# Altium schematic sheet ETH_PHY.SchDoc: =SheetTitle_Top
size 420 x 297 mm; Author: G.Kasprowicz; CompanyName: WUT ISE; DrawnBy: G.Kasprowicz; Organization: WUT ISE; Address1: PW ISE; Address2: Nowowiejska 15/19 00-665 Warsaw; Address3: gkasprow@gmail.com; ModifiedBy: -; CheckedDate: -; Title2: ETH PHY; DivGrp: WUT ISE; Designer: G.Kasprowicz; ModifiedDate: -; ProjectName: Sensor Box
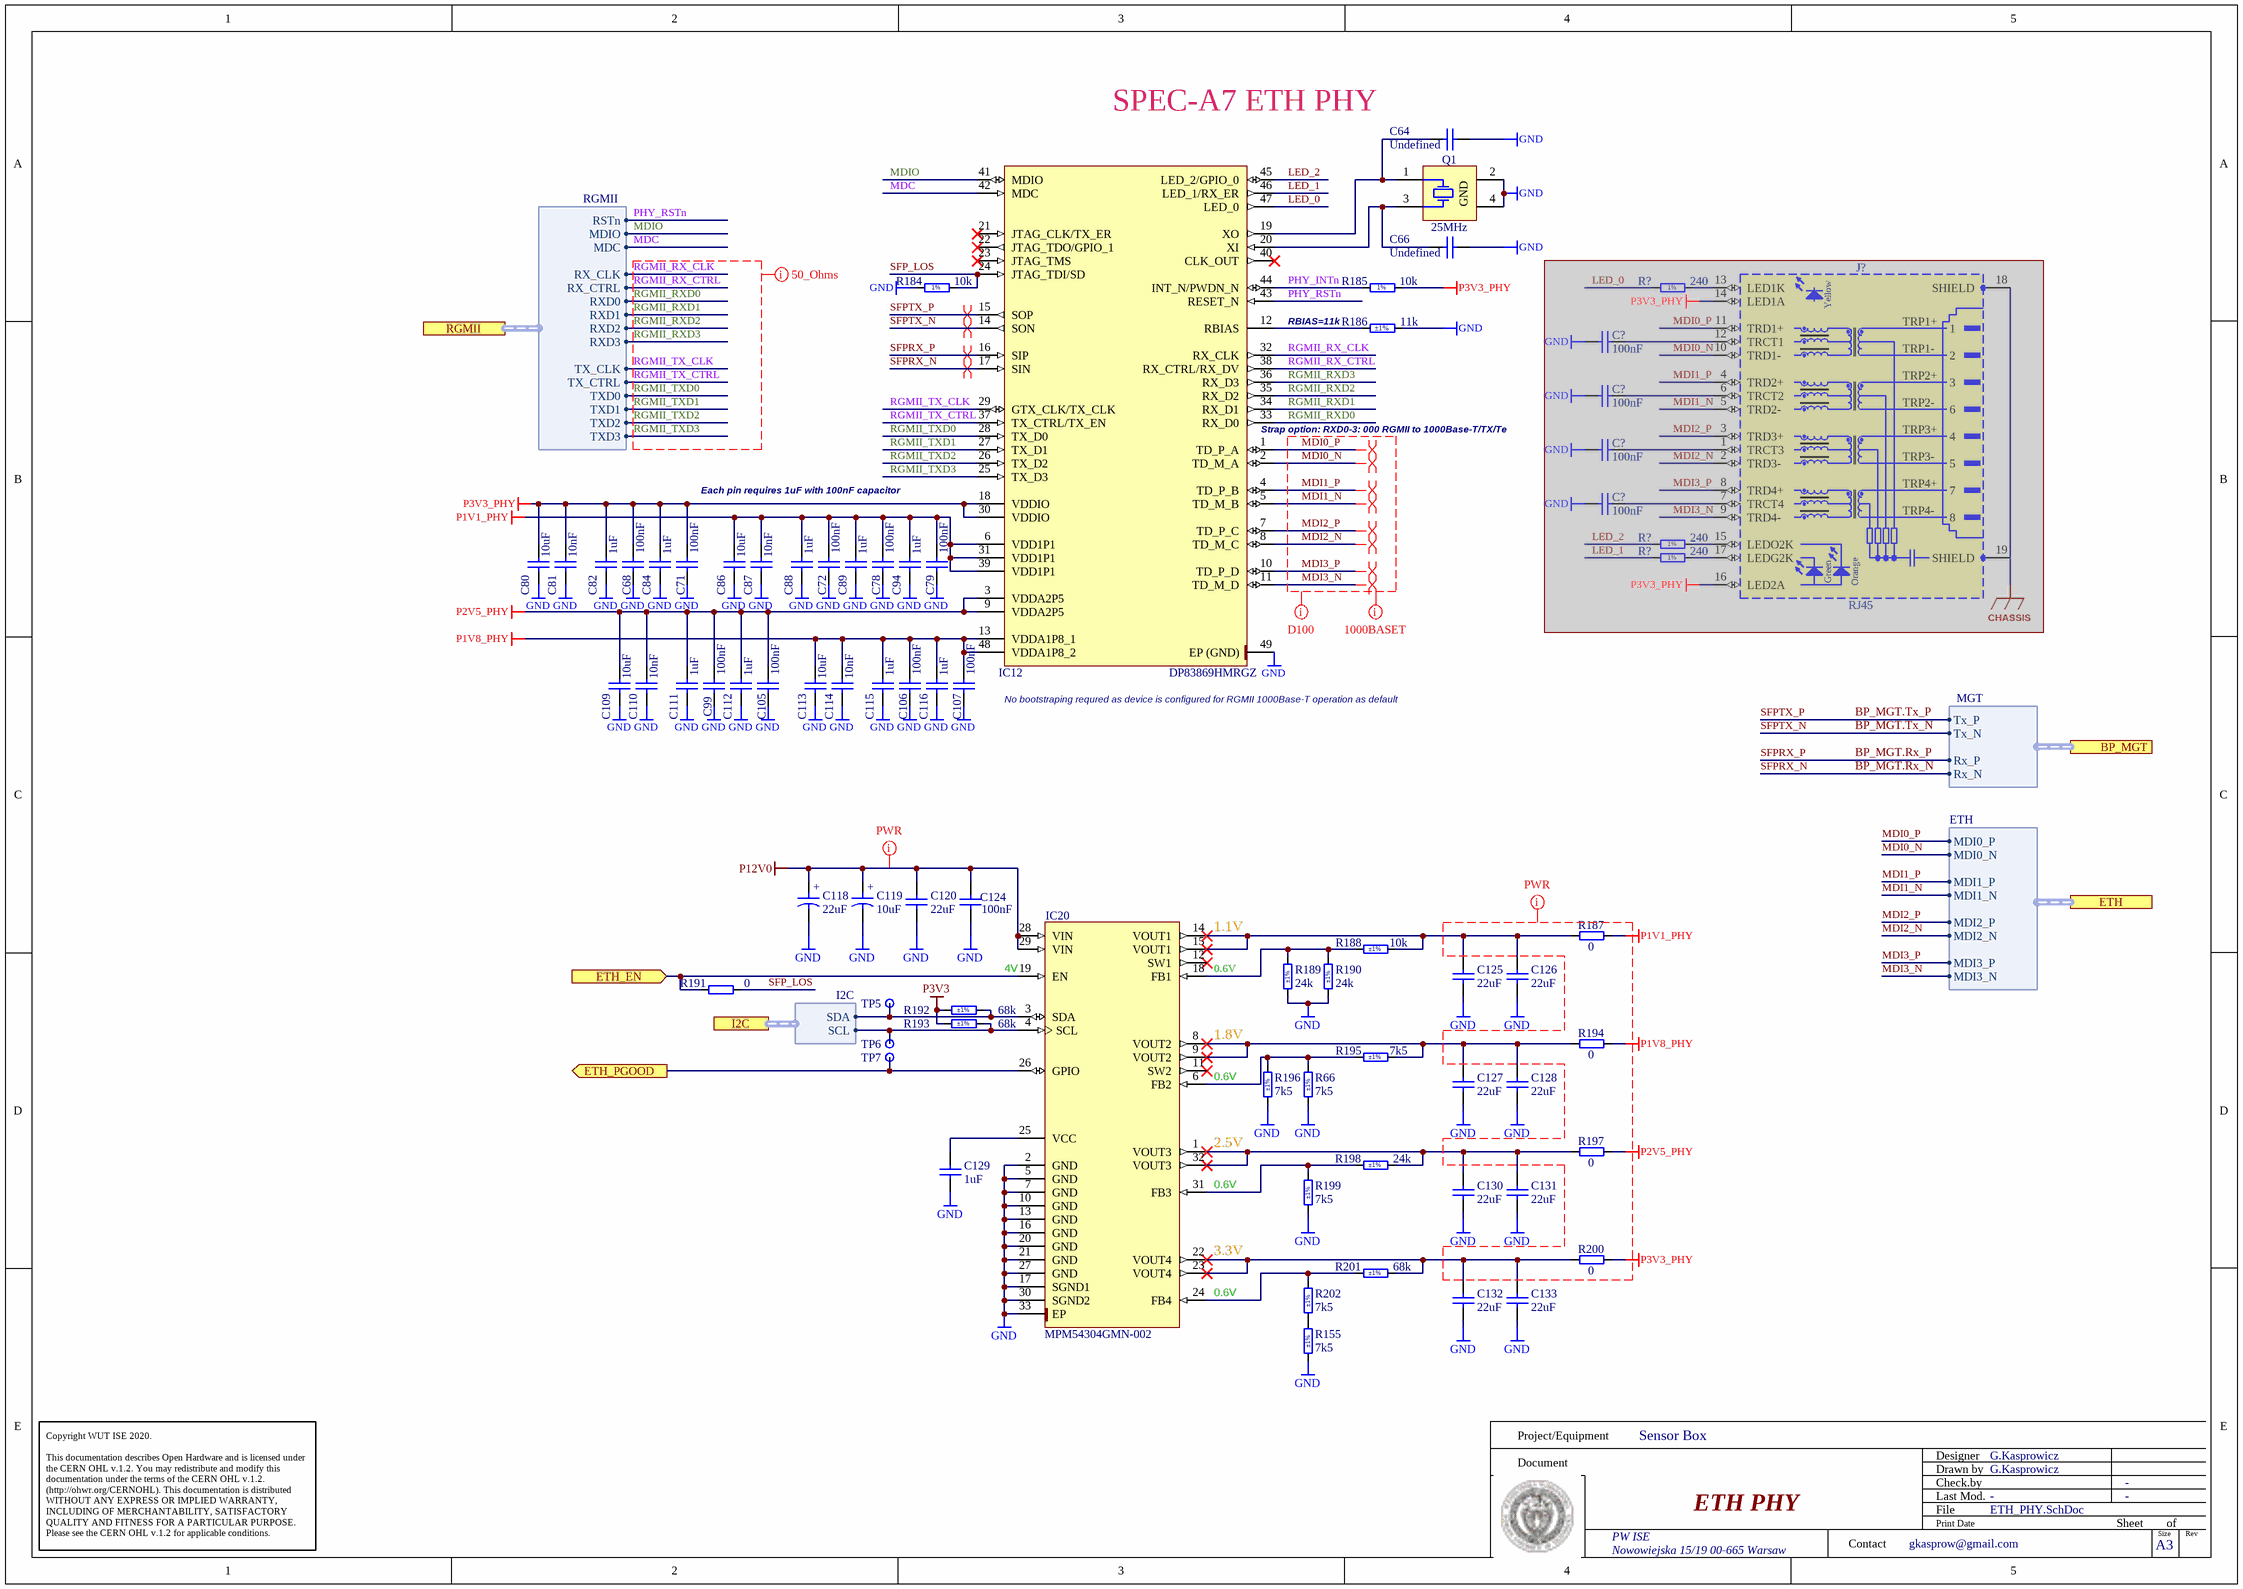
[diagram p0: ETH_PHY.SchDoc]

## Parts
(Parts that share a designator on the sheet are numbered #1, #2 ... from top to bottom, then left to right.)
C64  Undefined  [CAPC1005X55N]
C66  Undefined  [CAPC1005X55N]
C68  100nF  [CAPC1005X55N]
C71  100nF  [CAPC1005X55N]
C72  100nF  [CAPC1005X55N]
C78  100nF  [CAPC1005X55N]
C79  100nF  [CAPC1005X55N]
C80  10uF  [CAPC1608X80N]
C81  10nF  [CAPC1005X55N]
C82  1uF  [CAPC1005X55N]
C84  1uF  [CAPC1005X55N]
C86  10uF  [CAPC1608X80N]
C87  10nF  [CAPC1005X55N]
C88  1uF  [CAPC1005X55N]
C89  1uF  [CAPC1005X55N]
C94  1uF  [CAPC1005X55N]
C99  100nF  [CAPC1005X55N]
C105  100nF  [CAPC1005X55N]
C106  100nF  [CAPC1005X55N]
C107  100nF  [CAPC1005X55N]
C109  10uF  [CAPC1608X80N]
C110  10nF  [CAPC1005X55N]
C111  1uF  [CAPC1005X55N]
C112  1uF  [CAPC1005X55N]
C113  10uF  [CAPC1608X80N]
C114  10nF  [CAPC1005X55N]
C115  1uF  [CAPC1005X55N]
C116  1uF  [CAPC1005X55N]
C118  22uF  [CAPMP3528X210N]
C119  10uF  [CAPMP3216X180N]
C120  22uF  [CAPC2012X135N]
C124  100nF  [CAPC1005X55N]
C125  22uF  [CAPC2012X135N]
C126  22uF  [CAPC2012X135N]
C127  22uF  [CAPC2012X135N]
C128  22uF  [CAPC2012X135N]
C129  1uF  [CAPC1005X55N]
C130  22uF  [CAPC2012X135N]
C131  22uF  [CAPC2012X135N]
C132  22uF  [CAPC2012X135N]
C133  22uF  [CAPC2012X135N]
C?#1  100nF  [CAPC1005X55N]  (masked out: inside a compile mask, not in the netlist)
C?#2  100nF  [CAPC1005X55N]  (masked out: inside a compile mask, not in the netlist)
C?#3  100nF  [CAPC1005X55N]  (masked out: inside a compile mask, not in the netlist)
C?#4  100nF  [CAPC1005X55N]  (masked out: inside a compile mask, not in the netlist)
IC12  DP83869HMRGZ  [QFN50P700X700X100-49N-S420]
IC20  MPM54304GMN-002  [MPS_MPM54304GMN]
J?  RJ45  [BEL_L829-1J1T-43]  (masked out: inside a compile mask, not in the netlist)
Q1  25MHz  [XTAL_NDK_NX3225GA]
R66  7k5  Tolerance: ±1%  [RESC1005X40N]
R155  7k5  Tolerance: ±1%  [RESC1005X40N]
R184  10k  [RESC1005X40N]
R185  10k  [RESC1005X40N]
R186  11k  Tolerance: ±1%  [RESC1005X40N]
R187  0  [RESC1608X55N]
R188  10k  Tolerance: ±1%  [RESC1005X40N]
R189  24k  Tolerance: ±1%  [RESC1005X40N]
R190  24k  Tolerance: ±1%  [RESC1005X40N]
R191  0  [RESC1005X40N]
R192  68k  Tolerance: ±1%  [RESC1005X40N]
R193  68k  Tolerance: ±1%  [RESC1005X40N]
R194  0  [RESC1608X55N]
R195  7k5  Tolerance: ±1%  [RESC1005X40N]
R196  7k5  Tolerance: ±1%  [RESC1005X40N]
R197  0  [RESC1608X55N]
R198  24k  Tolerance: ±1%  [RESC1005X40N]
R199  7k5  Tolerance: ±1%  [RESC1005X40N]
R200  0  [RESC1608X55N]
R201  68k  Tolerance: ±1%  [RESC1005X40N]
R202  7k5  Tolerance: ±1%  [RESC1005X40N]
R?#1  240  [RESC1005X40N]  (masked out: inside a compile mask, not in the netlist)
R?#2  240  [RESC1005X40N]  (masked out: inside a compile mask, not in the netlist)
R?#3  240  [RESC1005X40N]  (masked out: inside a compile mask, not in the netlist)
TP5  Test Point  [TPS127]  (value not drawn)  (no BOM)
TP6  Test Point  [TPS127]  (value not drawn)  (no BOM)
TP7  Test Point  [TPS127]  (value not drawn)  (no BOM)

## Ports
BP_MGT (harness MGT), ETH (harness ETH), ETH_EN (in), ETH_PGOOD (out), I2C (harness I2C), RGMII (harness RGMII)

## Harnesses
I2C: SCL, SDA
RGMII: RSTn, MDIO, MDC, RX_CLK, RX_CTRL, RXD0, RXD1, RXD2, RXD3, TXD0, TXD1, TXD2, TXD3, TX_CTRL, TX_CLK
MGT: Tx_P, Tx_N, Rx_P, Rx_N
ETH: MDI0_P, MDI0_N, MDI1_P, MDI1_N, MDI2_P, MDI2_N, MDI3_P, MDI3_N

## Nets
GND: C64.2 C66.2 C68.1 C71.1 C72.1 C78.1 C79.1 C80.1 C81.1 C82.1 C84.1 C86.1 C87.1 C88.1 C89.1 C94.1 C99.1 C105.1 C106.1 C107.1 C109.1 C110.1 C111.1 C112.1 C113.1 C114.1 C115.1 C116.1 C118.2 C119.2 C120.1 C124.1 C125.1 C126.1 C127.1 C128.1 C129.1 C130.1 C131.1 C132.1 C133.1 IC12.49(EP_(GND)) IC20.2(GND) IC20.5(GND) IC20.7(GND) IC20.10(GND) IC20.13(GND) IC20.16(GND) IC20.17(SGND1) IC20.20(GND) IC20.21(GND) IC20.27(GND) IC20.30(SGND2) IC20.33(EP) Q1.2(GND) Q1.4(GND) R66.1 R155.1 R184.1 R186.2 R189.1 R190.1 R196.1 R199.1
P1V1_PHY: C72.2 C78.2 C79.2 C86.2 C87.2 C88.2 C89.2 C94.2 IC12.6(VDD1P1) IC12.31(VDD1P1) IC12.39(VDD1P1) R187.2
P1V8_PHY: C106.2 C107.2 C113.2 C114.2 C115.2 C116.2 IC12.13(VDDA1P8_1) IC12.48(VDDA1P8_2) R194.2
P2V5_PHY: C99.2 C105.2 C109.2 C110.2 C111.2 C112.2 IC12.3(VDDA2P5) IC12.9(VDDA2P5) R197.2
P3V3: R192.1 R193.1
P3V3_PHY: C68.2 C71.2 C80.2 C81.2 C82.2 C84.2 IC12.18(VDDIO) IC12.30(VDDIO) R185.2 R200.2
P12V0: C118.1 C119.1 C120.2 C124.2 IC20.28(VIN) IC20.29(VIN)
BP_MGT.Rx_N: IC12.17(SIN) ; port BP_MGT.Rx_N  [also labelled SFPRX_N]
BP_MGT.Rx_P: IC12.16(SIP) ; port BP_MGT.Rx_P  [also labelled SFPRX_P]
BP_MGT.Tx_N: IC12.14(SON) ; port BP_MGT.Tx_N  [also labelled SFPTX_N]
BP_MGT.Tx_P: IC12.15(SOP) ; port BP_MGT.Tx_P  [also labelled SFPTX_P]
ETH_EN: IC20.19(EN) R191.1 ; port ETH_EN
ETH_PGOOD: IC20.26(GPIO) TP7.1 ; port ETH_PGOOD
LED_0: IC12.47(LED_0)
LED_1: IC12.46(LED_1/RX_ER)
LED_2: IC12.45(LED_2/GPIO_0)
MDC: IC12.42(MDC) ; port RGMII.MDC
MDI0_N: IC12.2(TD_M_A) ; port ETH.MDI0_N
MDI0_P: IC12.1(TD_P_A) ; port ETH.MDI0_P
MDI1_N: IC12.5(TD_M_B) ; port ETH.MDI1_N
MDI1_P: IC12.4(TD_P_B) ; port ETH.MDI1_P
MDI2_N: IC12.8(TD_M_C) ; port ETH.MDI2_N
MDI2_P: IC12.7(TD_P_C) ; port ETH.MDI2_P
MDI3_N: IC12.11(TD_M_D) ; port ETH.MDI3_N
MDI3_P: IC12.10(TD_P_D) ; port ETH.MDI3_P
MDIO: IC12.41(MDIO) ; port RGMII.MDIO
PHY_INTn: IC12.44(INT_N/PWDN_N) R185.1
PHY_RSTn: IC12.43(RESET_N) ; port RGMII.RSTn
RGMII_RX_CLK: IC12.32(RX_CLK) ; port RGMII.RX_CLK
RGMII_RX_CTRL: IC12.38(RX_CTRL/RX_DV) ; port RGMII.RX_CTRL
RGMII_RXD0: IC12.33(RX_D0) ; port RGMII.RXD0
RGMII_RXD1: IC12.34(RX_D1) ; port RGMII.RXD1
RGMII_RXD2: IC12.35(RX_D2) ; port RGMII.RXD2
RGMII_RXD3: IC12.36(RX_D3) ; port RGMII.RXD3
RGMII_TX_CLK: IC12.29(GTX_CLK/TX_CLK) ; port RGMII.TX_CLK
RGMII_TX_CTRL: IC12.37(TX_CTRL/TX_EN) ; port RGMII.TX_CTRL
RGMII_TXD0: IC12.28(TX_D0) ; port RGMII.TXD0
RGMII_TXD1: IC12.27(TX_D1) ; port RGMII.TXD1
RGMII_TXD2: IC12.26(TX_D2) ; port RGMII.TXD2
RGMII_TXD3: IC12.25(TX_D3) ; port RGMII.TXD3
SFP_LOS: IC12.24(JTAG_TDI/SD) R184.2 R191.2
NetC64_1: C64.1 IC12.19(XO) Q1.1(X)
NetC66_1: C66.1 IC12.20(XI) Q1.3(X)
NetC125_2: C125.2 C126.2 IC20.14(VOUT1) IC20.15(VOUT1) R187.1 R188.2
NetC127_2: C127.2 C128.2 IC20.8(VOUT2) IC20.9(VOUT2) R194.1 R195.2
NetC129_2: C129.2 IC20.25(VCC)
NetC130_2: C130.2 C131.2 IC20.1(VOUT3) IC20.32(VOUT3) R197.1 R198.2
NetC132_2: C132.2 C133.2 IC20.22(VOUT4) IC20.23(VOUT4) R200.1 R201.2
NetIC12_12: IC12.12(RBIAS) R186.1
NetIC20_3: IC20.3(SDA) R192.2 TP5.1 ; port I2C.SDA
NetIC20_4: IC20.4(SCL) R193.2 TP6.1 ; port I2C.SCL
NetIC20_6: IC20.6(FB2) R66.2 R195.1 R196.2
NetIC20_18: IC20.18(FB1) R188.1 R189.2 R190.2
NetIC20_24: IC20.24(FB4) R201.1 R202.2
NetIC20_31: IC20.31(FB3) R198.1 R199.2
NetR155_2: R155.2 R202.1

Not connected (* = marked no-connect by the designer): IC12 21(JTAG_CLK/TX_ER)* 22(JTAG_TDO/GPIO_1)* 23(JTAG_TMS)* 40(CLK_OUT)*; IC20 11(SW2)* 12(SW1)*

## Layout directives
differential pair: BP_MGT.Rx_N, BP_MGT.Rx_P, BP_MGT.Tx_N, BP_MGT.Tx_P, MDI0_N, MDI0_P, MDI1_N, MDI1_P, MDI2_N, MDI2_P, MDI3_N, MDI3_P
net class D100: MDI0_N, MDI0_P, MDI1_N, MDI1_P, MDI2_N, MDI2_P, MDI3_N, MDI3_P
net class 1000BASET: MDI0_N, MDI0_P, MDI1_N, MDI1_P, MDI2_N, MDI2_P, MDI3_N, MDI3_P
net class PWR: P1V1_PHY, P1V8_PHY, P2V5_PHY, P3V3_PHY, P12V0
net class 50_Ohms: RGMII_RX_CLK, RGMII_RX_CTRL, RGMII_RXD0, RGMII_RXD1, RGMII_RXD2, RGMII_RXD3, RGMII_TX_CLK, RGMII_TX_CTRL, RGMII_TXD0, RGMII_TXD1, RGMII_TXD2, RGMII_TXD3

## Notes on the sheet
- SPEC-A7 ETH PHY
- RBIAS=11k
- (near IC12) Strap option: RXD0-3: 000 RGMII to 1000Base-T/TX/Te
- Each pin requires 1uF with 100nF capacitor
- No bootstraping requred as device is configured for RGMII 1000Base-T operation as default
- 1.1V
- 4V
- 0.6V
- 1.8V
- (near IC20) 0.6V
- 2.5V
- (near IC20) 3.3V
- Project/Equipment
- Document
- Designer
- Drawn by
- Check.by
- Copyright WUT ISE 2020.
  This documentation describes Open Hardware and is licensed under the CERN OHL v.1.2. You may redistribute and modify this documentation under the terms of the CERN OHL v.1.2. (http://ohwr.org/CERNOHL). This documentation is distributed WITHOUT ANY EXPRESS OR IMPLIED WARRANTY, INCLUDING OF MERCHANTABILITY, SATISFACTORY QUALITY AND FITNESS FOR A PARTICULAR PURPOSE. Please see the CERN OHL v.1.2 for applicable conditions.
- Contact
- File
- Last Mod.
- Print Date
- Sheet
- Size
- A3
- of
- Rev
- (in symbol BELFUSE_L829-1J1T-43) Yellow; TRP1+; TRP1-; TRP2+; TRP2-; TRP3+; TRP3-; TRP4+; TRP4-; Green; Orange
- (in symbol CTE3216-18_10UF_16V_20%_AVX_TCJ) +
- (in symbol CTE3528-21_22UF_10V_10%_LESR0700) +
- (in symbol R0402_10K_1%_0.0625W_100PPM) 1%
- (in symbol R0402_240R_1%_0.0625W_100PPM) 1%

## Library data of the parts
C64 C66 = CC0402_NO-VALUE: Non-polarised capacitor; Part Description: Reserved Footprint For 0402(1005) Chip Ceramic Capacitor; Mounted: No; Part Number: CC0402_NO-VALUE; Component Kind: Standard; Component Type: Standard; Pin Count: 2; Value: Undefined; Status: None; Manufacturer: Undefined; Manufacturer Part Number: CC0402_NO-VALUE; Case: 0402; Socket: No; SMD: Yes; Sense: No; Manufacturer1 ComponentHeight: 0.55mm; HelpURL: Undefined; Author: CERN DEM JLC; CreateDate: 14/01/2014; LatestRevisionDate: 14/01/2014
C68 C71 C72 C78 C79 C99 C105-C107 C124 = CC0402_100NF_16V_10%_X5R: Non-polarised capacitor; Part Description: SMD Multilayer Chip Ceramic Capacitor; Manufacturer: GENERIC; Manufacturer1 Part Number: GRM155R61C104KA88D; Voltage: 16V; TC: X5R; Tolerance: ±10%; Part Number: CC0402_100NF_16V_10%_X5R; Component Kind: Standard; Component Type: Standard; Pin Count: 2; Value: 100nF; Status: None; Manufacturer Part Number: CC0402_100NF_16V_10%_X5R; Case: 0402; Mounted: Yes; Socket: No; SMD: Yes; Sense: No; Manufacturer1 Example: MURATA; Manufacturer1 ComponentHeight: 0.55mm; HelpURL: \\cern.ch\dfs\Applications\Altium\Datasheets\CC0402_X5R_MURATA_GRM.pdf; Author: CERN DEM JLC; CreateDate: 10.12.2013; LatestRevisionDate: 10.12.2013
C80 C86 C109 C113 = CC0603_10UF_16V_20%_X5R: Non-polarised capacitor; Part Description: SMD Multilayer Chip Ceramic Capacitor; Manufacturer: GENERIC; Manufacturer1 Part Number: GRM188R61C106MA73D; Voltage: 16V; TC: X5R; Tolerance: ±20%; Part Number: CC0603_10UF_16V_20%_X5R; Component Kind: Standard; Component Type: Standard; Pin Count: 2; Value: 10uF; Status: None; Manufacturer Part Number: CC0603_10UF_16V_20%_X5R; Case: 0603; Mounted: Yes; Socket: No; SMD: Yes; Sense: No; Manufacturer1 Example: MURATA; Manufacturer1 ComponentHeight: 0.8mm; HelpURL: \\cern.ch\dfs\Applications\Altium\Datasheets\CC0603_X5R_MURATA_GRM.pdf; Author: CERN DEM MR; CreateDate: 02.03.2016; LatestRevisionDate: 02.03.2016
C81 C87 C110 C114 = CC0402_10NF_16V_10%_X7R: Non-polarised capacitor; Part Description: SMD Multilayer Chip Ceramic Capacitor; Manufacturer: GENERIC; Manufacturer1 Part Number: 223878715636; Voltage: 16V; TC: X7R; Tolerance: ±10%; Part Number: CC0402_10NF_16V_10%_X7R; Component Kind: Standard; Component Type: Standard; Pin Count: 2; Value: 10nF; Status: Not Recommended; Manufacturer Part Number: CC0402_10NF_16V_10%_X7R; Case: 0402; Mounted: Yes; Socket: No; SMD: Yes; Sense: No; Manufacturer1 Example: PHYCOMP; Manufacturer1 ComponentHeight: 0.55mm; HelpURL: \\cern.ch\dfs\Applications\Altium\Datasheets\CC0402_X7R_PHYCOMP.pdf; Author: CERN DEM JLC; CreateDate: 03.12.2007; LatestRevisionDate: 03.12.2007
C82 C84 C88 C89 C94 C111 C112 C115 C116 C129 = CC0402_1UF_16V_10%_X5R: Non-polarised capacitor; Part Description: SMD Multilayer Chip Ceramic Capacitor; Manufacturer: GENERIC; Manufacturer1 Part Number: C1005X5R1C105KT; Voltage: 16V; TC: X5R; Tolerance: ±10%; Part Number: CC0402_1UF_16V_10%_X5R; Component Kind: Standard; Component Type: Standard; Pin Count: 2; Value: 1uF; Status: Preferred; Manufacturer Part Number: CC0402_1UF_16V_10%_X5R; Case: 0402; Mounted: Yes; Socket: No; SMD: Yes; Sense: No; Manufacturer1 Example: TDK; Manufacturer1 ComponentHeight: 0.55mm; HelpURL: \\cern.ch\dfs\Applications\Altium\Datasheets\CC0402_X5R_TDK_C.pdf; Author: CERN DEM JLC
  C82 C84 C88 C89 C94 C111 C112 C115 C116: CreateDate: 2012-10-25; LatestRevisionDate: 2012-10-25
  C129: CreateDate: 25.10.2012; LatestRevisionDate: 25.10.2012
C118 = CTE3528-21_22UF_10V_10%_LESR0700: Polarised capacitor; Part Description: Low ESR 0R7 Solid Tantalum Chip Capacitor; Manufacturer: GENERIC; Manufacturer1 Part Number: TPSB226K010R0700; Voltage: 10V; Tolerance: ±10%; Part Number: CTE3528-21_22UF_10V_10%_LESR0700; Component Kind: Standard; Component Type: Standard; Pin Count: 2; Value: 22uF; Status: Preferred; Manufacturer Part Number: CTE3528-21_22UF_10V_10%_LESR0700; Case: B; Mounted: Yes; Socket: No; SMD: Yes; Sense: No; Manufacturer1 Example: AVX; Manufacturer1 ComponentHeight: 2.1mm; HelpURL: \\cern.ch\dfs\Applications\Altium\Datasheets\CTE-LESR_AVX_TPS.pdf; Author: CERN DEM JLC; CreateDate: 05.05.2008; LatestRevisionDate: 20.01.2009
C119 = CTE3216-18_10UF_16V_20%_AVX_TCJ: Polarised capacitor; Part Description: ESR 0R200 Tantalum Solid Electrolytic Chip Capacitor with Conductive Polymer Electrode; Manufacturer: AVX; Manufacturer Part Number: TCJA106M016R0200; Voltage: 16V; Tolerance: ±20%; Part Number: CTE3216-18_10UF_16V_20%_AVX_TCJ; Component Kind: Standard; Component Type: Standard; Pin Count: 2; Value: 10uF; Status: Preferred; Case: A; Mounted: Yes; Socket: No; SMD: Yes; Sense: No; ComponentHeight: 1.8mm; HelpURL: \\cern.ch\dfs\Applications\Altium\Datasheets\CTE_AVX_TCJ.pdf; Author: CERN DEM JLC; CreateDate: 29.03.2012; LatestRevisionDate: 29.03.2012
C120 C125-C128 C130-C133 = CC0805_22UF_16V_10%_X5R: Non-polarised capacitor; Manufacturer: GENERIC; Part Description: SMD Multilayer Chip Ceramic Capacitor; Manufacturer1 Part Number: C2012X5R1C226KT; Tolerance: ±10%; Voltage: 16V; TC: X5R; Manufacturer Part Number: CC0805_22UF_16V_10%_X5R; Part Number: CC0805_22UF_16V_10%_X5R; Value: 22uF; Component Kind: Standard; Component Type: Standard; Pin Count: 2; Status: Preferred; Case: 0805; Mounted: Yes; Socket: No; SMD: Yes; Sense: No; Manufacturer1 Example: TDK; Manufacturer1 ComponentHeight: 1.35mm; HelpURL: \\cern.ch\dfs\Applications\Altium\Datasheets\CC0805_X5R_TDK_C.pdf; Author: CERN DEM JLC; CreateDate: 25.10.2012; LatestRevisionDate: 25.10.2012
C?#1-C?#4 = CC0402_100NF_16V_10%_X7R: Non-polarised capacitor; Part Description: SMD Multilayer Chip Ceramic Capacitor; Manufacturer: GENERIC; Manufacturer1 Part Number: GRM155R71C104KA88D; Voltage: 16V; TC: X7R; Tolerance: ±10%; Part Number: CC0402_100NF_16V_10%_X7R; Component Kind: Standard; Component Type: Standard; Pin Count: 2; Value: 100nF; Status: Not Recommended; Manufacturer Part Number: CC0402_100NF_16V_10%_X7R; Case: 0402; Mounted: Yes; Socket: No; SMD: Yes; Sense: No; Manufacturer1 Example: MURATA; Manufacturer1 ComponentHeight: 0.55mm; HelpURL: \\cern.ch\dfs\Applications\Altium\Datasheets\CC0402_X7R_MURATA_GRM.pdf; Author: CERN DEM JLC; CreateDate: 05/12/2013; LatestRevisionDate: 03/12/2007
IC12 = DP83869HMRGZ: DP83869HM High Immunity 10/100/1000 Ethernet Physical Layer Transceiver WithCopper and Fiber Interface; Manufacturer: TEXAS INSTRUMENTS; PressFit: No; Bonding: No; Part Number: DP83869HMRGZ; Component Kind: Standard; Component Type: Standard; Device: DP83869HMRGZ; PackageDescription: QFN, 0.50mm Pitch, Square; 48 Pin, 7.00mm L X 7.00mm W X 1.00mm H body (w/Thermal Tab 4.20 X 4.20mm), IPC Medium Density; Part Description: High Immunity 10/100/1000 Ethernet Physical Layer Transceiver with Copper and Fiber Interface; Manufacturer Part Number: DP83869HMRGZ; Pin Count: 48; Case: QFN48; Mounted: Yes; Socket: No; SMD: Yes; Sense: No; ComponentHeight: 1mm; Author: CERN DEM HF; HelpURL: \\cern.ch\dfs\Applications\Altium\Datasheets\DP83869HMRGZ.pdf; CreateDate: 24.04.2024; LatestRevisionDate: 24.04.2024
IC20 = MPM54304GMN-XXXX: Quad-Output Power Module with I2C and MTP; Part Description: 4V to 16V Input, Quad-Output Power Module with I2C and MTP; Manufacturer: MPS (MONOLITIC  POWER SYSTEMS); PressFit: No; Bonding: No; Part Number: MPM54304GMN-002; Component Kind: Standard; Component Type: Standard; Device: MPM54304GMN-002; PackageDescription: MPS LGA-33 Case, 0.65mm Pitch, Rect.; 32 Pin, 7.00mm L X 7.00mm W X 2.10mm H body (w/Thermal Tab 3.55 X 3.55mm); Manufacturer Part Number: MPM54304GMN-002; Pin Count: 33; Case: QFN32; Mounted: Yes; Socket: No; SMD: Yes; Sense: No; ComponentHeight: 2.1mm; HelpURL: \\cern.ch\dfs\Applications\Altium\Datasheets\MPM54304GMN.pdf; Author: CERN DEM BC; CreateDate: 09.11.2020; LatestRevisionDate: 23.11.2022
J? = BELFUSE_L829-1J1T-43: 1 Port, RJ45, Gigabit Ethernet, MagJack Connector Module With Yellow And Green/Orange LEDs; Part Description: 1 Port, Yellow/ Green-Orange LEDs,  RJ45 10/100/1000 Gigabit Ethernet, MagJack® Connector Module; Manufacturer: BEL MAGNETIC SOLUTIONS; PressFit: No; Part Number: BELFUSE_L829-1J1T-43; Component Kind: Standard; Component Type: Standard; Pin Count: 19; Family: RJ45; Mounted: Yes; Socket: No; SMD: No; Sense: No; Status: None; Manufacturer Part Number: L829-1J1T-43; ComponentHeight: 13.3mm; HelpURL: \\cern.ch\dfs\Applications\Altium\Datasheets\BEL_L829-1J1T-43.pdf; Author: CERN DEM JLC; CreateDate: 22.08.2011; LatestRevisionDate: 20.09.2018
Q1 = XTAL_25MHZ_NDK_NX3225GA: Crystal 4 pins 1=XTAL Control 2=GND3=XTAL 4=GND; Part Description: Tolerance: ± 20ppm, Stability: ± 30ppm, -40°C to +85°C, 8pF, 50 Ohms ESR, Automotive Quartz Crystal, NX3225GA Series; Manufacturer: NDK; Manufacturer Part Number: NX3225GA-25.000M-STD-CRG; PressFit: No; Bonding: No; Part Number: XTAL_25MHZ_NDK_NX3225GA; Component Kind: Standard; Component Type: Standard; PackageDescription: 4 Pins, SMD Crystal, Body 2.5x3.2mm, NX3225GA Series; Value: 25MHz; Pin Count: 4; Mounted: Yes; Socket: No; SMD: Yes; Sense: No; ComponentHeight: 0.9mm; HelpURL: \\cern.ch\dfs\Applications\Altium\Datasheets\XTAL_NDK_NX3225GA.pdf; Author: CERN DEM MR; CreateDate: 15/02/2018; LatestRevisionDate: 15/02/2018
R66 R155 R195 R196 R199 R202 = R0402_7K5_1%_0.0625W_100PPM: Resistor - 1%; Part Description: General Purpose Thick Film Chip Resistor; Manufacturer: GENERIC; Manufacturer1 Part Number: 232270677502L; TC: ±100ppm/°C; PressFit: No; Part Number: R0402_7K5_1%_0.0625W_100PPM; Component Kind: Standard; Component Type: Standard; Pin Count: 2; Value: 7k5; Status: Not Recommended; Power: 0.0625W; Manufacturer Part Number: R0402_7K5_1%_0.0625W_100PPM; Case: 0402; Mounted: Yes; Sense: No; Socket: No; SMD: Yes; Manufacturer1 Example: YAGEO PHYCOMP; Manufacturer1 ComponentHeight: 0.4mm; HelpURL: \\cern.ch\dfs\Applications\Altium\Datasheets\R0402_Phycomp_RC0402.pdf; Author: CERN DEM JLC; CreateDate: 03.12.2007; LatestRevisionDate: 17.10.2012
R184 R185 R188 = R0402_10K_1%_0.0625W_100PPM: Resistor - 1%; Part Description: General Purpose Thick Film Chip Resistor; Manufacturer: GENERIC; Manufacturer1 Part Number: 232270671003L; TC: ±100ppm/°C; PressFit: No; Part Number: R0402_10K_1%_0.0625W_100PPM; Component Kind: Standard; Component Type: Standard; Pin Count: 2; Value: 10k; Status: Not Recommended; Power: 0.0625W; Manufacturer Part Number: R0402_10K_1%_0.0625W_100PPM; Case: 0402; Mounted: Yes; Sense: No; Socket: No; SMD: Yes; Manufacturer1 Example: YAGEO PHYCOMP; Manufacturer1 ComponentHeight: 0.4mm; HelpURL: \\cern.ch\dfs\Applications\Altium\Datasheets\R0402_Phycomp_RC0402.pdf; Author: CERN DEM JLC; CreateDate: 03.12.2007; LatestRevisionDate: 17.10.2012
  R184 R185: Tolerance: ±1%
R186 = R0402_11K_1%_0.0625W_100PPM: Resistor - 1%; Part Description: General Purpose Thick Film Chip Resistor; Manufacturer: GENERIC; Manufacturer1 Part Number: 232270671103L; TC: ±100ppm/°C; PressFit: No; Part Number: R0402_11K_1%_0.0625W_100PPM; Component Kind: Standard; Component Type: Standard; Pin Count: 2; Value: 11k; Status: Not Recommended; Power: 0.0625W; Manufacturer Part Number: R0402_11K_1%_0.0625W_100PPM; Case: 0402; Mounted: Yes; Sense: No; Socket: No; SMD: Yes; Manufacturer1 Example: YAGEO PHYCOMP; Manufacturer1 ComponentHeight: 0.4mm; HelpURL: \\cern.ch\dfs\Applications\Altium\Datasheets\R0402_Phycomp_RC0402.pdf; Author: CERN DEM JLC; CreateDate: 03.12.2007; LatestRevisionDate: 17.10.2012
R187 R194 R197 R200 = R0603_0R_JUMPER: Resistor; Part Description: 1A (0.05R Max DC Resistance) Zero Ohm Jumper; Manufacturer: GENERIC; Manufacturer1 Part Number: NRC06Z0; PressFit: No; Part Number: R0603_0R_JUMPER; Component Kind: Standard; Component Type: Standard; Pin Count: 2; Value: 0; Status: Preferred; Manufacturer Part Number: R0603_0R_JUMPER; Case: 0603; Mounted: Yes; Sense: No; Socket: No; SMD: Yes; Manufacturer1 Example: NIC COMPONENT; Manufacturer1 ComponentHeight: 0.55mm; HelpURL: \\cern.ch\dfs\Applications\Altium\Datasheets\R0603_NIC_NRC.pdf; Author: CERN DEM JLC; CreateDate: 03.12.2007; LatestRevisionDate: 13.03.2008
R189 R190 R198 = R0402_24K_1%_0.0625W_100PPM: Resistor - 1%; Part Description: General Purpose Thick Film Chip Resistor; Manufacturer: GENERIC; Manufacturer1 Part Number: 232270672403L; TC: ±100ppm/°C; PressFit: No; Part Number: R0402_24K_1%_0.0625W_100PPM; Component Kind: Standard; Component Type: Standard; Pin Count: 2; Value: 24k; Status: Not Recommended; Power: 0.0625W; Manufacturer Part Number: R0402_24K_1%_0.0625W_100PPM; Case: 0402; Mounted: Yes; Sense: No; Socket: No; SMD: Yes; Manufacturer1 Example: YAGEO PHYCOMP; Manufacturer1 ComponentHeight: 0.4mm; HelpURL: \\cern.ch\dfs\Applications\Altium\Datasheets\R0402_Phycomp_RC0402.pdf; Author: CERN DEM JLC; CreateDate: 03.12.2007; LatestRevisionDate: 17.10.2012
R191 = R0402_0R_JUMPER: Resistor; Part Description: 1A (0.05R Max DC Resistance) Zero Ohm Jumper; Manufacturer: GENERIC; Manufacturer1 Part Number: 232270591001L; PressFit: No; Part Number: R0402_0R_JUMPER; Component Kind: Standard; Component Type: Standard; Pin Count: 2; Value: 0; Status: Not Recommended; Manufacturer Part Number: R0402_0R_JUMPER; Case: 0402; Mounted: Yes; Sense: No; Socket: No; SMD: Yes; Manufacturer1 Example: YAGEO PHYCOMP; Manufacturer1 ComponentHeight: 0.4mm; HelpURL: \\cern.ch\dfs\Applications\Altium\Datasheets\R0402_Phycomp_RC0402.pdf; Author: CERN DEM JLC; CreateDate: 03.12.2007; LatestRevisionDate: 17.10.2012
R192 R193 R201 = R0402_68K_1%_0.0625W_100PPM: Resistor - 1%; Part Description: General Purpose Thick Film Chip Resistor; Manufacturer: GENERIC; Manufacturer1 Part Number: 232270676803L; TC: ±100ppm/°C; PressFit: No; Part Number: R0402_68K_1%_0.0625W_100PPM; Component Kind: Standard; Component Type: Standard; Pin Count: 2; Value: 68k; Status: Not Recommended; Power: 0.0625W; Manufacturer Part Number: R0402_68K_1%_0.0625W_100PPM; Case: 0402; Mounted: Yes; Sense: No; Socket: No; SMD: Yes; Manufacturer1 Example: YAGEO PHYCOMP; Manufacturer1 ComponentHeight: 0.4mm; HelpURL: \\cern.ch\dfs\Applications\Altium\Datasheets\R0402_Phycomp_RC0402.pdf; Author: CERN DEM JLC; CreateDate: 03.12.2007; LatestRevisionDate: 17.10.2012
R?#1-R?#3 = R0402_240R_1%_0.0625W_100PPM: Resistor - 1%; Part Description: General Purpose Thick Film Chip Resistor; Manufacturer: GENERIC; Manufacturer1 Part Number: 232270672401L; TC: ±100ppm/°C; PressFit: No; Part Number: R0402_240R_1%_0.0625W_100PPM; Component Kind: Standard; Component Type: Standard; Pin Count: 2; Value: 240; Status: Not Recommended; Power: 0.0625W; Tolerance: ±1%; Manufacturer Part Number: R0402_240R_1%_0.0625W_100PPM; Case: 0402; Mounted: Yes; Sense: No; Socket: No; SMD: Yes; Manufacturer1 Example: YAGEO PHYCOMP; Manufacturer1 ComponentHeight: 0.4mm; HelpURL: \\cern.ch\dfs\Applications\Altium\Datasheets\R0402_Phycomp_RC0402.pdf; Author: CERN DEM JLC; CreateDate: 03.12.2007; LatestRevisionDate: 17.10.2012
TP5-TP7 = SMD_PAD_1.27X1.27MM: Part Description: 1.27mm x 1.27mm PCB Copper Area (SMD Test Point); Mounted: No; Part Number: SMD_PAD_1.27X1.27MM; Component Type: Standard (No BOM); Pin Count: 1; Family: Test Point; Socket: No; SMD: Yes; Sense: No; Status: None; ComponentHeight: 0mm; HelpURL: Undefined; Author: CERN DEM JLC; CreateDate: 12.01.2008; LatestRevisionDate: 12.01.2008; PackageDescription: 1.27mm x 1.27mm PCB Copper Area (SMD Test Point)